# EAGLE design umodular_pot8 (EAGLE 7.2.0)
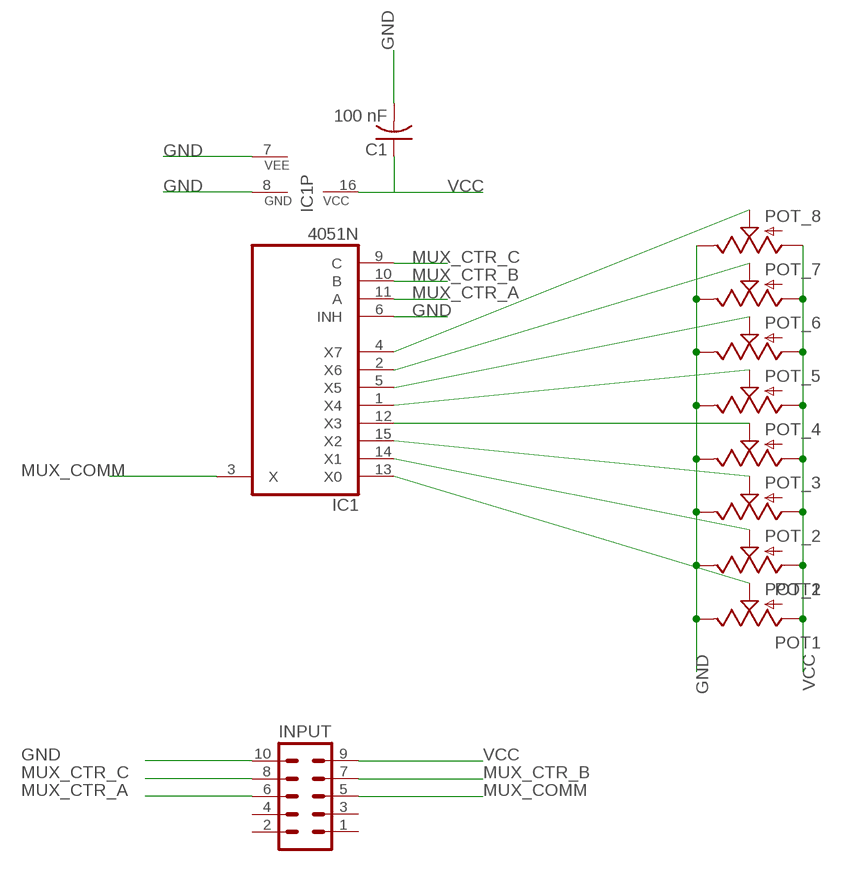
[diagram p0: schematic, sheet 1]

## Parts
C1  100 nF  C-US050-024X044  [C050-024X044]
IC1  4051N  [DIL16]
INPUT  MA05-2  [MA05-2]
POT_1  POT1  POT  [ALPS_POT]
POT_2  POT2  POT  [ALPS_POT]
POT_3  POT  [ALPS_POT]
POT_4  POT  [ALPS_POT]
POT_5  POT  [ALPS_POT]
POT_6  POT  [ALPS_POT]
POT_7  POT  [ALPS_POT]
POT_8  POT  [ALPS_POT]

## Nets
GND: C1.2 IC1.6(INH) IC1.7(VEE) IC1.8(GND) INPUT.10 POT_1.P$1(E) POT_2.P$1(E) POT_3.P$1(E) POT_4.P$1(E) POT_5.P$1(E) POT_6.P$1(E) POT_7.P$1(E) POT_8.P$1(E)
MUX_COMM: IC1.3(X) INPUT.5
MUX_CTR_A: IC1.11(A) INPUT.6
MUX_CTR_B: IC1.10(B) INPUT.7
MUX_CTR_C: IC1.9(C) INPUT.8
N$1: IC1.5(X5) POT_6.P$2(S)
N$2: IC1.2(X6) POT_7.P$2(S)
N$266: IC1.13(X0) POT_1.P$2(S)
N$267: IC1.14(X1) POT_2.P$2(S)
N$268: IC1.15(X2) POT_3.P$2(S)
N$269: IC1.12(X3) POT_4.P$2(S)
N$270: IC1.1(X4) POT_5.P$2(S)
N$273: IC1.4(X7) POT_8.P$2(S)
VCC: C1.1 IC1.16(VCC) INPUT.9 POT_1.P$3(A) POT_2.P$3(A) POT_3.P$3(A) POT_4.P$3(A) POT_5.P$3(A) POT_6.P$3(A) POT_7.P$3(A) POT_8.P$3(A)
Unconnected: INPUT.1 INPUT.2 INPUT.3 INPUT.4

## Library data of the parts
C1 = rcl:C-US: CAPACITOR, American symbol
IC1 = 40xx:4051: 8-channel ANALOG MULTIPLEXER
INPUT = con-lstb:MA05-2: PIN HEADER; OC_FARNELL: unknown; OC_NEWARK: unknown
POT_1-POT_8 = SparkFun-Electromechanical_mod:POT

## Board
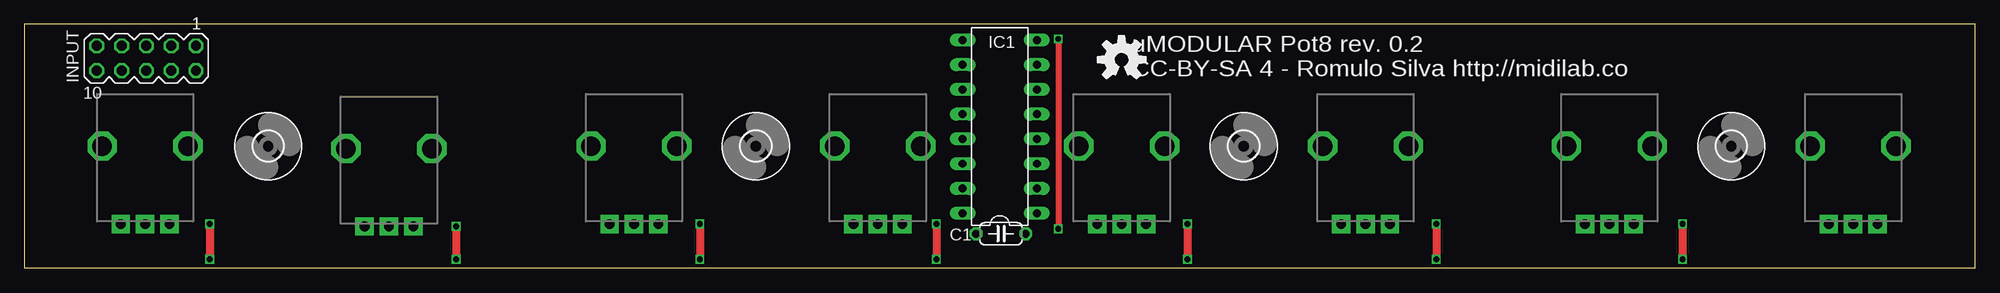
[diagram p1: board, top side]
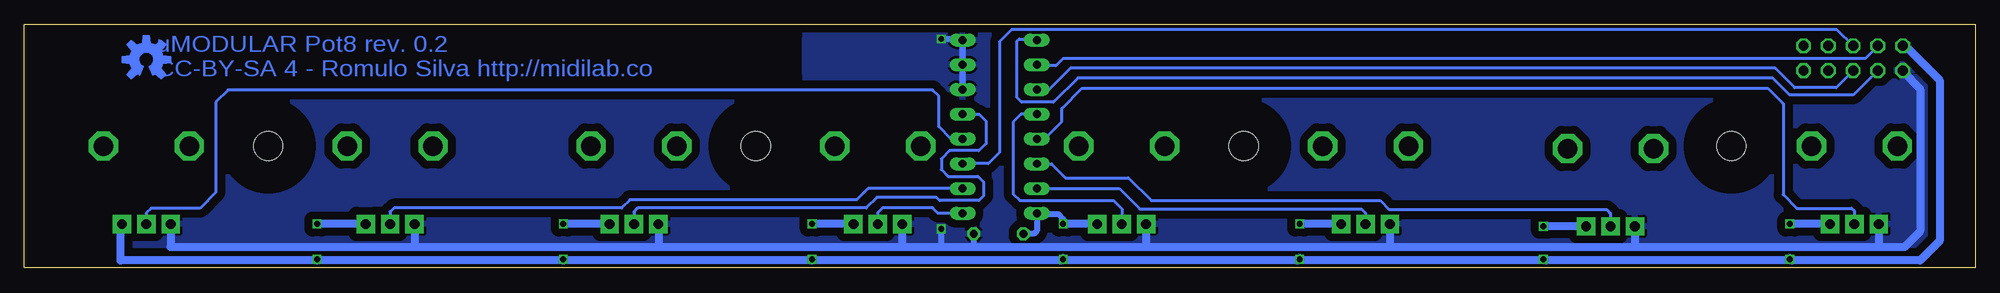
[diagram p2: board, bottom side, seen from below]

Size 200 x 25 mm. Coordinates in mm from the lower left corner, seen from the top.
Outline: 0,0 200,0 200,25 0,25 0,0
Copper layers (1*16): Top 0.035mm / dielectric 1.5mm / Bottom 0.035mm
Design rules "SeeedStudio_2layer_DRU_no_angle_20140221": minimum track width 6mil, minimum drill 12mil, track to track 6mil, track to pad 6mil, pad to pad 6mil, via to via 6mil, smd to smd 0mil, copper to edge 10mil, drill to drill 10mil, minimum pad ring 10mil, minimum via ring 6mil, stop-mask expansion 2mil, vias tented up to drill 100mil, thermal gap 10mil

### Footprints (pad centres in the part's own frame; a part is rotated, then mirrored left to right if it is on the bottom)
C050-024X044 = drill 0.813 octagon: 1 -2.54,0; 2 2.54,0
DIL16 = drill 0.813 long: 1 -8.89,-3.81; 2 -6.35,-3.81; 3 -3.81,-3.81; 4 -1.27,-3.81; 5 1.27,-3.81; 6 3.81,-3.81; 7 6.35,-3.81; 8 8.89,-3.81; 9 8.89,3.81; 10 6.35,3.81; 11 3.81,3.81; 12 1.27,3.81; 13 -1.27,3.81; 14 -3.81,3.81; 15 -6.35,3.81; 16 -8.89,3.81
MA05-2 = drill 1.016 octagon: 1 -5.08,-1.27; 2 -5.08,1.27; 3 -2.54,-1.27; 4 -2.54,1.27; 5 0,-1.27; 6 0,1.27; 7 2.54,-1.27; 8 2.54,1.27; 9 5.08,-1.27; 10 5.08,1.27
ALPS_POT = drill 1 pad 1.88 square: P$1 8,-2.5; P$2 8,0; P$3 8,2.5 | drill 2 octagon: P$4 0,-4.4; P$5 0,4.4
3,0 = hole 3: 0,0

### Placement (x,y rotation side)
C1  100.12,3.5 0 top
IC1  100,14.5 90 top
INPUT  12.51,21.52 180 top
POT_1  12.38,12.5 270 top
POT_2  37.38,12.25 270 top
POT_3  62.5,12.5 270 top
POT_4  87.5,12.5 270 top
POT_5  112.5,12.5 270 top
POT_6  137.5,12.5 270 top
POT_7  162.5,12.5 270 top
POT_8  187.5,12.5 270 top
U$1  [3,0]  25,12.5 0 top
U$2  [3,0]  175,12.5 0 top
U$3  [3,0]  75,12.5 0 top
U$4  [3,0]  125,12.5 0 top
U$5  [OSHW-LOGO-M]  187.5,21.38 0 top
U$6  [OSHW-LOGO-M]  112.5,21.38 0 top

### Tracks (layer width: path | path; a pad name or v marks a point on that pad's centre or on a via)
GND  (via drill 0.6)
  Top 0.61: v106,23.5 v106,4
  Bottom 0.61: IC1.8 IC1.7 IC1.6 | IC1.6 103.81,23.31 104,23.5 | 102.75,2.12 102.67,2.21 C1.2 | IC1.6 103.81,23.44 103.75,23.5 v106,23.5 | v106,4 106,2.12
  Bottom 0.813: INPUT.10 7.43,20.18 5.62,18.38 5.62,3.75 7.25,2.12 9.89,2.12 | 9.89,2.12 34.98,2.12 | 34.98,2.12 59.88,2.12 | 59.88,2.12 85.25,2.12 | POT_3.P$1 60,2.25 59.88,2.12 | POT_4.P$1 85,2.38 85.25,2.12 | 85.25,2.12 102.75,2.12 106,2.12 109.75,2.12 | 109.75,2.12 134.75,2.12 | 134.75,2.12 160.24,2.12 | 160.24,2.12 185,2.12 POT_8.P$1 | POT_5.P$1 110,2.38 109.75,2.12 | POT_6.P$1 135,2.38 134.75,2.12 | POT_7.P$1 160,2.36 160.24,2.12 | POT_1.P$1 9.88,2.26 9.89,2.12 | POT_2.P$1 34.88,2.23 34.98,2.12
  pour Bottom (isolate 0.813): 0.5,25 200,25 200,0 0.5,0
MUX_COMM
  Bottom 0.305: IC1.3 101.17,10.7 100,11.88 100,23.25 98.75,24.5 14.22,24.5 INPUT.5
MUX_CTR_A
  Bottom 0.305: INPUT.6 14.25,18.5 18.5,18.5 20.5,20.5 92.75,20.5 95,18.25 96.13,18.25 IC1.11
MUX_CTR_B
  Bottom 0.305: INPUT.7 11.25,21.5 93.5,21.5 94.25,20.75 96.09,20.75 IC1.10
MUX_CTR_C
  Bottom 0.305: INPUT.8 10,20.25 12.5,17.75 19,17.75 20.75,19.5 92,19.5 94.5,17 97.75,17 98.25,17.5 98.25,23.25 98,23.5 96.3,23.5 IC1.9
N$1
  Bottom 0.305: IC1.5 102.11,15.77 101.4,15.06 101.4,12.76 102.14,12.03 105.15,12.03 105.99,11.19 105.99,10.09 105.3,9.4 102.24,9.4 101.65,8.81 101.65,7.4 102.15,6.9 106.15,6.9 106.5,7.25 112.59,7.25 113.7,6.14 137.11,6.14 137.51,5.74 137.51,4.51 POT_6.P$2
N$2
  Bottom 0.305: IC1.2 113.5,8.15 114.66,6.99 137.91,6.99 138.75,6.15 162.11,6.15 162.5,5.76 POT_7.P$2
N$266
  Bottom 0.305: IC1.13 95.43,13.23 93.64,15.03 93.64,16.38 91.56,18.45 21.27,18.45 19.68,16.85 19.68,7.54 18.26,6.12 12.68,6.12 12.38,5.83 POT_1.P$2
N$267
  Bottom 0.305: POT_2.P$2 37.38,5.6 37.77,6 60.09,6 60.99,6.9 84.46,6.9 86.81,9.25 93.25,9.25 94.69,10.69 IC1.14
N$268
  Bottom 0.305: POT_3.P$2 62.5,5.64 62.91,6.05 85.65,6.05 87.75,8.15 IC1.15
N$269
  Bottom 0.305: IC1.12 97.81,15.77 98.62,14.95 98.62,7.59 97.95,6.91 88.33,6.91 87.49,6.08 87.49,4.51 POT_4.P$2
N$270
  Bottom 0.305: IC1.1 106.32,5.61 106.88,6.16 112.01,6.16 112.51,5.66 112.51,4.51 POT_5.P$2
N$273
  Bottom 0.305: IC1.4 104.98,13.23 106.25,14.5 106.25,17.62 106.88,18.25 179.12,18.25 180.38,17 180.38,7.75 182,6.12 187,6.12 187.5,5.62 POT_8.P$2
VCC  (via drill 0.6)
  Top 0.813: v44.25,4.25 v44.25,0.88 | v69.25,4.5 v69.25,0.88 | v93.5,4.5 v93.5,0.88 | v119.25,4.5 v119.25,0.88 | v144.75,4.5 v144.75,0.88 | v170,4.5 v170,0.88 | v18.99,4.5 18.99,1.26 v19,0.88
  Bottom 0.61: C1.1 96.5,3.5 96.19,3.81 IC1.16 96.08,5.5 94,5.5 93.5,5 v93.5,4.5
  Bottom 0.813: INPUT.9 7.17,22.79 3.62,19.25 3.62,2.75 5.62,0.75 18.75,0.75 | 93.38,4.5 POT_4.P$3 v93.5,4.5 | 18.75,0.75 44,0.75 | 44,0.75 69.5,0.75 | 69.5,0.75 93.75,0.75 | 93.75,0.75 119.25,0.75 | 119.25,0.75 144.75,0.75 | 144.75,0.75 170,0.75 | 170,0.75 190.12,0.75 190.12,3.88 POT_8.P$3 | 119,4.5 POT_5.P$3 v119.25,4.5 | POT_6.P$3 v144.75,4.5 | POT_7.P$3 v170,4.5 | 44.08,4.25 POT_2.P$3 v44.25,4.25 | 69.11,4.51 69.1,4.5 POT_3.P$3 v69.25,4.5 | POT_1.P$3 v18.99,4.5 | v44.25,0.88 44,0.75 | v69.25,0.88 69.25,1 69.5,0.75 | v93.5,0.88 93.5,1 93.75,0.75 | v119.25,0.88 119.25,0.75 | v144.75,0.88 144.75,0.75 | v170,0.88 170,0.75 | v19,0.88 19,1 18.75,0.75

### Text on the board
Bottom: uMODULAR Pot8 rev. 0.2 / CC-BY-SA 4 - Romulo Silva http://midilab.co
tNames: uMODULAR Pot8 rev. 0.2 / CC-BY-SA 4 - Romulo Silva http://midilab.co